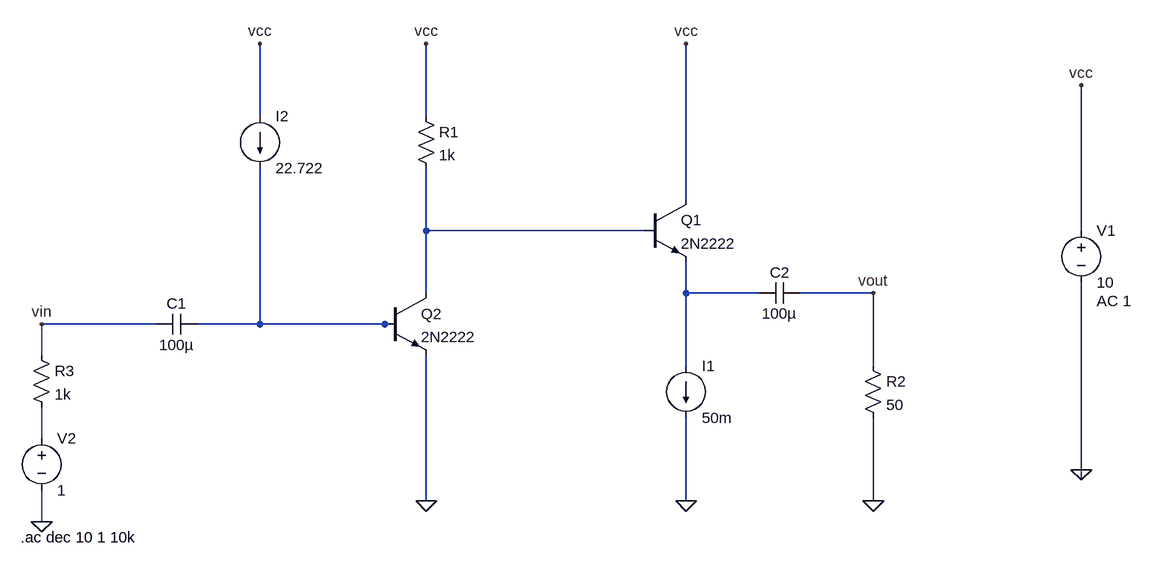
[diagram p0: schematic meros 2o D).asc]
meros 2o D).asc, the LTspice schematic file:
Version 4
SHEET 1 1088 696
WIRE -256 32 -256 -80
WIRE 0 32 0 -80
WIRE 400 160 400 -80
WIRE 0 208 0 112
WIRE 336 208 0 208
WIRE 1008 208 1008 -16
WIRE 0 304 0 208
WIRE 400 304 400 256
WIRE 512 304 400 304
WIRE 688 304 576 304
WIRE -416 352 -592 352
WIRE -256 352 -256 112
WIRE -256 352 -352 352
WIRE -64 352 -256 352
WIRE -48 352 -64 352
WIRE -592 400 -592 352
WIRE 400 416 400 304
WIRE 688 416 688 304
WIRE -592 528 -592 480
WIRE 1008 576 1008 288
WIRE 1008 592 1008 576
WIRE 0 624 0 400
WIRE 400 624 400 496
WIRE 688 624 688 496
WIRE -592 656 -592 608
FLAG 400 624 0
FLAG 688 624 0
FLAG -592 656 0
FLAG 1008 576 0
FLAG 0 -80 vcc
FLAG 400 -80 vcc
FLAG -256 -80 vcc
FLAG 1008 -16 vcc
FLAG 0 624 0
FLAG 688 304 vout
FLAG -592 352 vin
SYMBOL npn 336 160 R0
SYMATTR InstName Q1
SYMATTR Value 2N2222
SYMBOL npn -64 304 R0
SYMATTR InstName Q2
SYMATTR Value 2N2222
SYMBOL res -16 16 R0
SYMATTR InstName R1
SYMATTR Value 1k
SYMBOL res 672 400 R0
SYMATTR InstName R2
SYMATTR Value 50
SYMBOL res -608 384 R0
SYMATTR InstName R3
SYMATTR Value 1k
SYMBOL cap -352 336 R90
WINDOW 0 0 32 VBottom 2
WINDOW 3 32 32 VTop 2
SYMATTR InstName C1
SYMATTR Value 100µ
SYMBOL cap 576 288 R90
WINDOW 0 0 32 VBottom 2
WINDOW 3 32 32 VTop 2
SYMATTR InstName C2
SYMATTR Value 100µ
SYMBOL current 400 416 R0
WINDOW 123 0 0 Left 0
WINDOW 39 0 0 Left 0
SYMATTR InstName I1
SYMATTR Value 50m
SYMBOL current -256 32 R0
WINDOW 123 0 0 Left 0
WINDOW 39 0 0 Left 0
SYMATTR InstName I2
SYMATTR Value 22.722
SYMBOL voltage 1008 192 R0
WINDOW 123 24 124 Left 2
WINDOW 39 0 0 Left 0
SYMATTR Value2 AC 1
SYMATTR InstName V1
SYMATTR Value 10
SYMBOL voltage -592 512 R0
WINDOW 123 0 0 Left 0
WINDOW 39 0 0 Left 0
SYMATTR InstName V2
SYMATTR Value 1
TEXT -624 680 Left 2 !.ac dec 10 1 10k

The netlist it stands for:
* meros 2o D).asc
Q1 vcc N001 N002 0 2N2222
Q2 N001 N003 0 0 2N2222
R1 vcc N001 1k
R2 vout 0 50
R3 vin N004 1k
C1 N003 vin 100µ
C2 vout N002 100µ
I1 N002 0 50m
I2 vcc N003 22.722
V1 vcc 0 10 AC 1
V2 N004 0 1
.model NPN NPN
.model PNP PNP
.lib standard.bjt
.ac dec 10 1 10k
.backanno
.end